# Altium schematic sheet ArduinoUnoShield.SchDoc
size A4
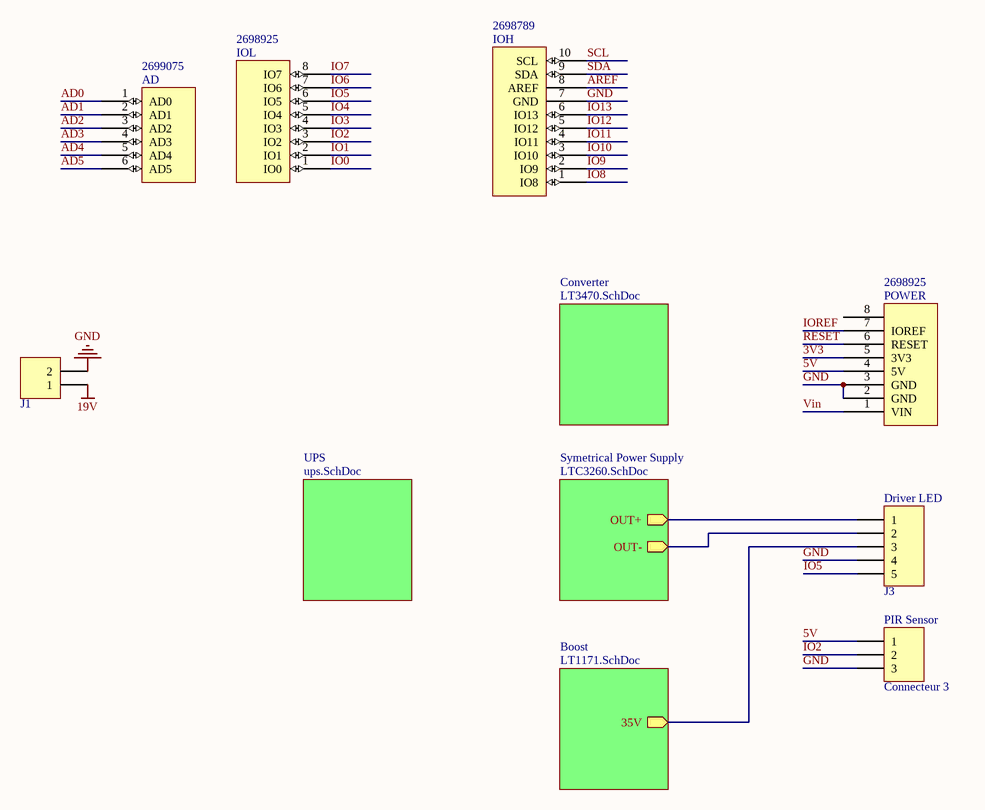
[diagram p0: ArduinoUnoShield.SchDoc]

## Parts
AD  Supplier Part Number 4: 2699075  [Header 6x1 8.5mm]  (hidden comment: AD)
IOH  Supplier Part Number 3: 2698789  [Header 10x1 8.5mm]  (hidden comment: IOH)
IOL  Supplier Part Number 4: 2698925  [Header 8x1 8.5mm]  (hidden comment: IOL)
J1  Connecteur 2  [Jack_connector]  (value not drawn)
J3  Driver LED  [Connector 5]
PIR_Sensor  Connecteur 3  [Connector 3]
POWER  Supplier Part Number 4: 2698925  [Header 8x1 8.5mm]  (hidden comment: POWER_UNO)

## Sub-sheets
Boost = LT1171.SchDoc: 35V (out)
Converter = LT3470.SchDoc: no entries
Symetrical Power Supply = LTC3260.SchDoc: OUT+ (out), OUT- (out)
UPS = ups.SchDoc: no entries

## Nets
19V: J1.1
GND: IOH.7(GND) J1.2 J3.4 PIR_Sensor.3 POWER.2(GND) POWER.3(GND)
3V3: POWER.5(3V3)
5V: PIR_Sensor.1 POWER.4(5V)
AD0: AD.1(AD0)
AD1: AD.2(AD1)
AD2: AD.3(AD2)
AD3: AD.4(AD3)
AD4: AD.5(AD4)
AD5: AD.6(AD5)
AREF: IOH.8(AREF)
IO0: IOL.1(IO0)
IO1: IOL.2(IO1)
IO2: IOL.3(IO2) PIR_Sensor.2
IO3: IOL.4(IO3)
IO4: IOL.5(IO4)
IO5: IOL.6(IO5) J3.5
IO6: IOL.7(IO6)
IO7: IOL.8(IO7)
IO8: IOH.1(IO8)
IO9: IOH.2(IO9)
IO10: IOH.3(IO10)
IO11: IOH.4(IO11)
IO12: IOH.5(IO12)
IO13: IOH.6(IO13)
IOREF: POWER.7(IOREF)
RESET: POWER.6(RESET)
SCL: IOH.10(SCL)
SDA: IOH.9(SDA)
Vin: POWER.1(VIN)
NetJ3_1: J3.1 ; sheet Symetrical Power Supply/OUT+
NetJ3_2: J3.2 ; sheet Symetrical Power Supply/OUT-
NetJ3_3: J3.3 ; sheet Boost/35V

Not connected (* = marked no-connect by the designer): POWER 8

## Library data of the parts
J1 = Connecteur 2: Connecteur; Designer: ECAM 2005; Type: Connecteur à vis
J3 = Connecteur 5: Connecteur; Designer: ECAM 2004
AD = AD: Supplier 1: Arrow; Supplier Part Number 1: 2699089; Supplier 2: Digi-Key; Supplier Part Number 2: SAM1198-06-ND; Supplier 3: Arrow; Supplier Part Number 3: 2699088; Supplier 4: Arrow
IOH = IOH: Supplier 1: Arrow; Supplier Part Number 1: 2698803S4475693N1004; Supplier 2: Digi-Key; Supplier Part Number 2: SAM1198-10-ND; Supplier 3: Arrow
IOL = IOL: Supplier 1: Digi-Key; Supplier Part Number 1: SAM1198-08-ND; Supplier 2: Arrow; Supplier Part Number 2: 2698939; Supplier 3: Arrow; Supplier Part Number 3: 2698940; Supplier 4: Arrow
POWER = POWER_UNO: Supplier 1: Digi-Key; Supplier Part Number 1: SAM1198-08-ND; Supplier 2: Arrow; Supplier Part Number 2: 2698939; Supplier 3: Arrow; Supplier Part Number 3: 2698940; Supplier 4: Arrow